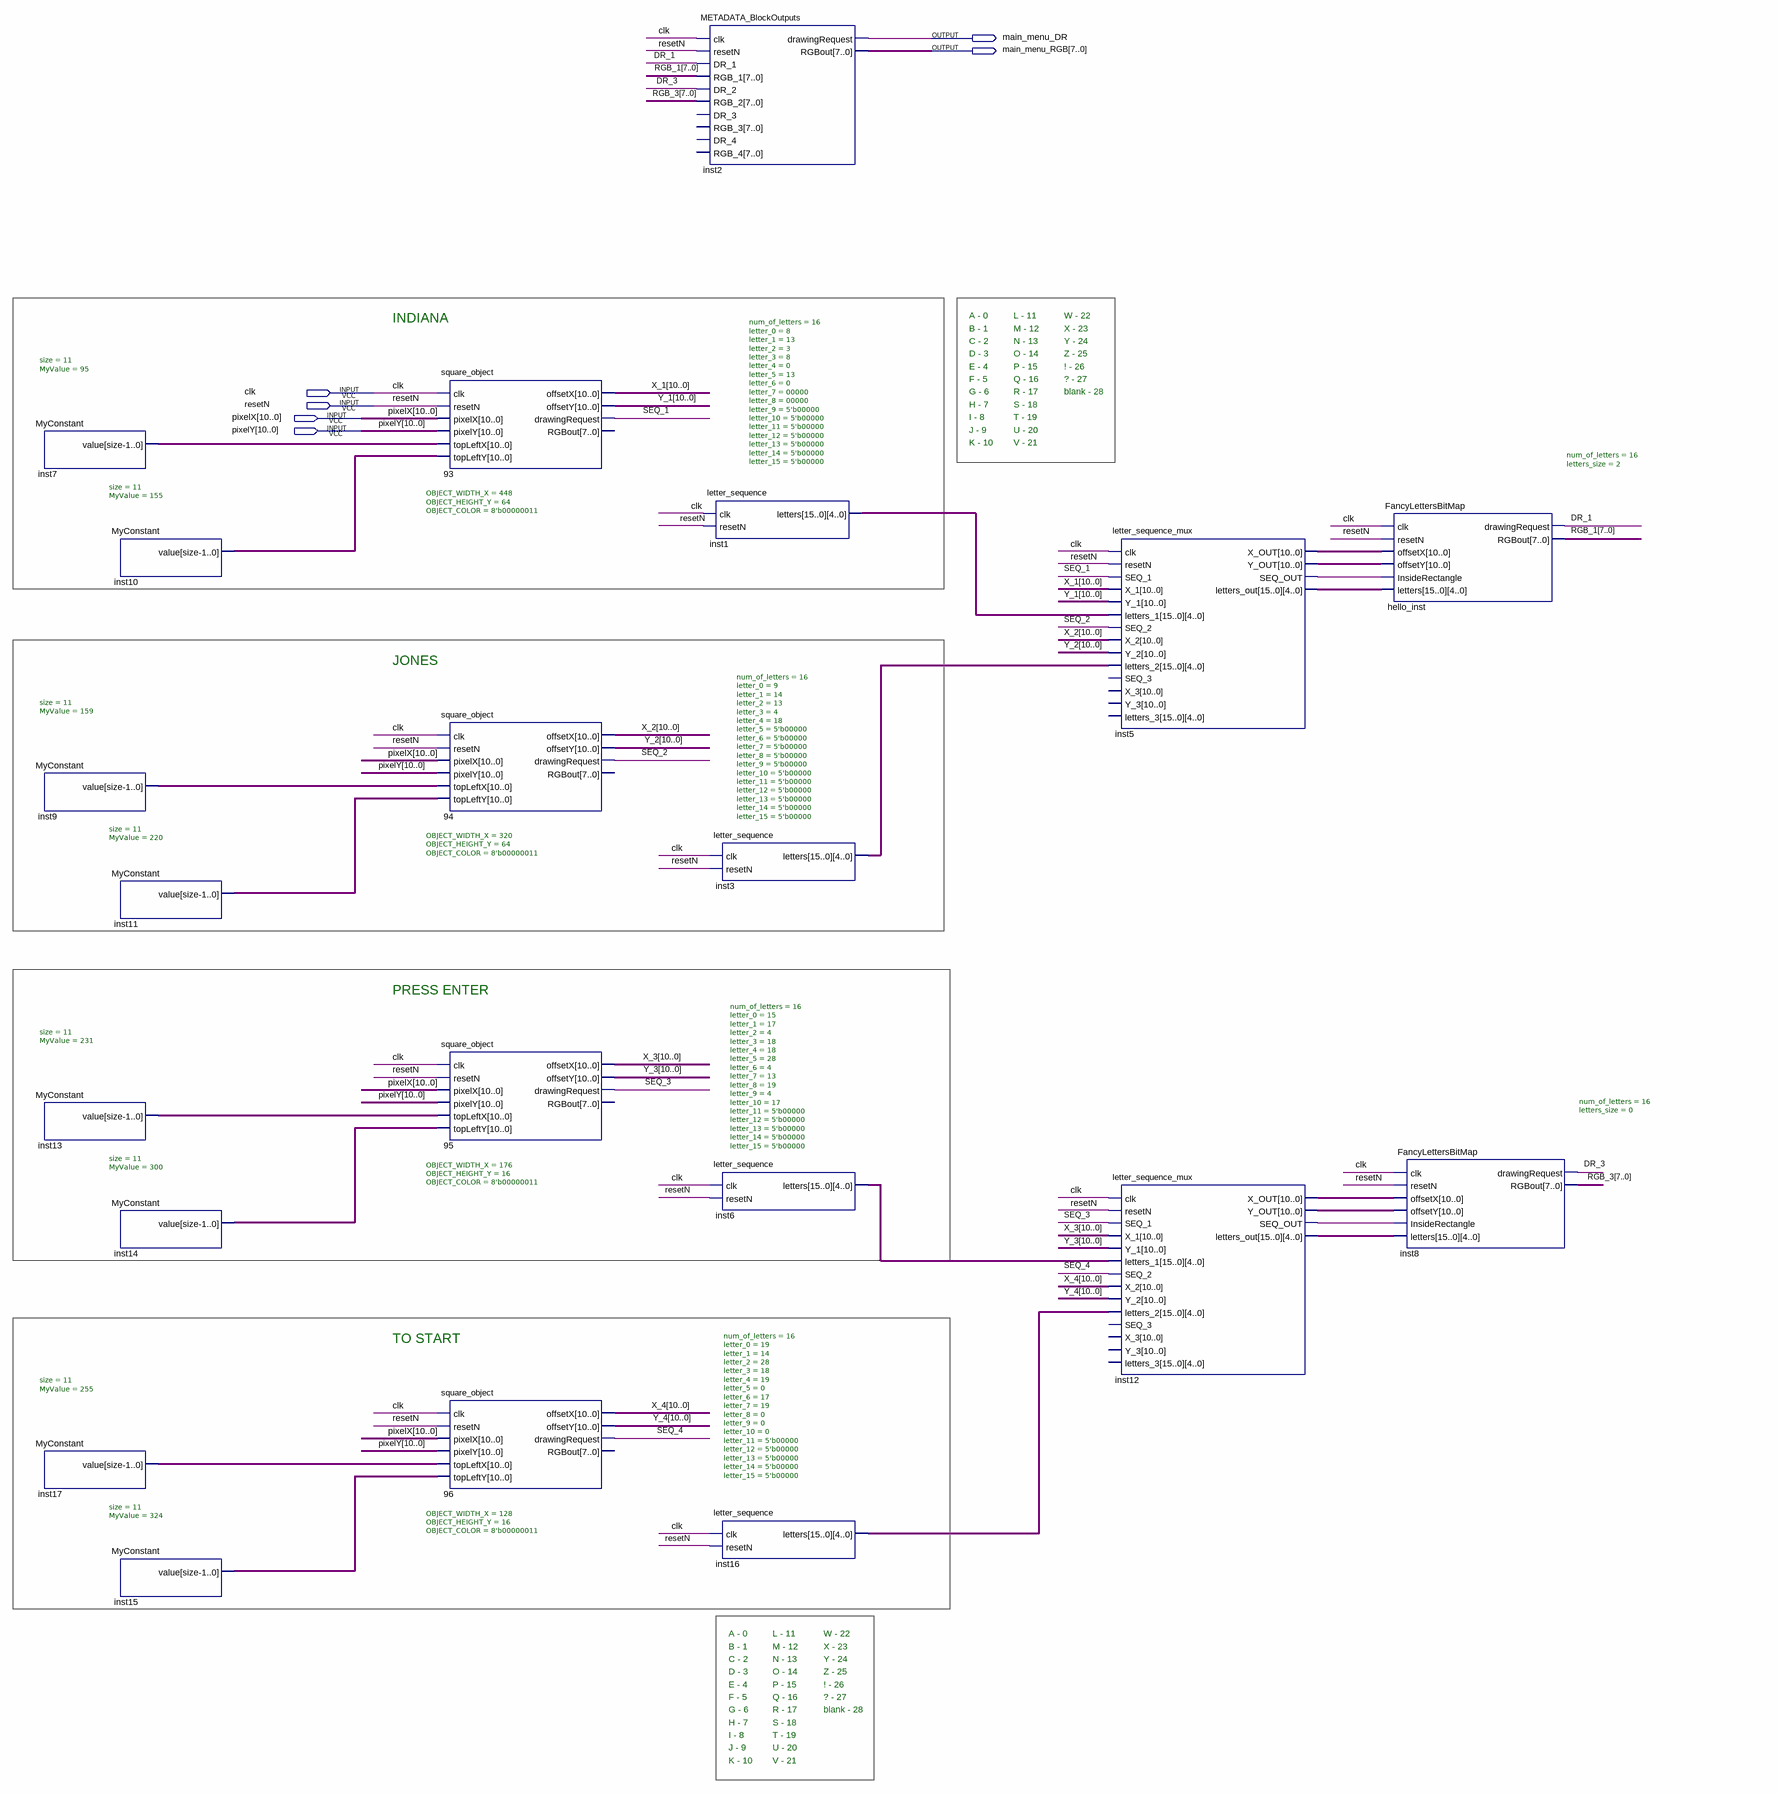
[diagram p0: schematic sheet]
// Quartus schematic Main_Menu_Screen_Block.bdf as structural Verilog: 21 symbols, 6 pins
module Main_Menu_Screen_Block (
  input  clk,
  input  resetN,
  input  [10:0] pixelX,
  input  [10:0] pixelY,
  output main_menu_DR,
  output [7:0] main_menu_RGB
);

  wire DR_1, DR_3, inst5_seq_out, inst12_seq_out, SEQ_1, SEQ_2, SEQ_3, SEQ_4;
  wire [7:0] RGB_1, RGB_3;
  wire [10:0] inst5_x_out, inst5_y_out, inst7_value, inst9_value, inst10_value, inst11_value, inst12_x_out,
       inst12_y_out, inst13_value, inst14_value, inst15_value, inst17_value, X_1, X_2, X_3, X_4, Y_1, Y_2,
       Y_3, Y_4;
  wire [79:0] inst1_letters, inst3_letters, inst5_letters_out, inst6_letters, inst12_letters_out,
       inst16_letters;

  MyConstant #(.size(11), .MyValue(95)) inst7 (.value(inst7_value));
  MyConstant #(.size(11), .MyValue(159)) inst9 (.value(inst9_value));
  MyConstant #(.size(11), .MyValue(231)) inst13 (.value(inst13_value));
  MyConstant #(.size(11), .MyValue(255)) inst17 (.value(inst17_value));
  MyConstant #(.size(11), .MyValue(155)) inst10 (.value(inst10_value));
  MyConstant #(.size(11), .MyValue(220)) inst11 (.value(inst11_value));
  MyConstant #(.size(11), .MyValue(300)) inst14 (.value(inst14_value));
  MyConstant #(.size(11), .MyValue(324)) inst15 (.value(inst15_value));
  square_object #(.OBJECT_WIDTH_X(448), .OBJECT_HEIGHT_Y(64), .OBJECT_COLOR(8'b00000011)) u_93 (
    .clk(clk), .resetN(resetN), .pixelX(pixelX), .pixelY(pixelY), .topLeftX(inst7_value),
    .topLeftY(inst10_value), .offsetX(X_1), .offsetY(Y_1), .drawingRequest(SEQ_1));  // open: RGBout
  square_object #(.OBJECT_WIDTH_X(320), .OBJECT_HEIGHT_Y(64), .OBJECT_COLOR(8'b00000011)) u_94 (
    .clk(clk), .resetN(resetN), .pixelX(pixelX), .pixelY(pixelY), .topLeftX(inst9_value),
    .topLeftY(inst11_value), .offsetX(X_2), .offsetY(Y_2), .drawingRequest(SEQ_2));  // open: RGBout
  square_object #(.OBJECT_WIDTH_X(176), .OBJECT_HEIGHT_Y(16), .OBJECT_COLOR(8'b00000011)) u_95 (
    .clk(clk), .resetN(resetN), .pixelX(pixelX), .pixelY(pixelY), .topLeftX(inst13_value),
    .topLeftY(inst14_value), .offsetX(X_3), .offsetY(Y_3), .drawingRequest(SEQ_3));  // open: RGBout
  square_object #(.OBJECT_WIDTH_X(128), .OBJECT_HEIGHT_Y(16), .OBJECT_COLOR(8'b00000011)) u_96 (
    .clk(clk), .resetN(resetN), .pixelX(pixelX), .pixelY(pixelY), .topLeftX(inst17_value),
    .topLeftY(inst15_value), .offsetX(X_4), .offsetY(Y_4), .drawingRequest(SEQ_4));  // open: RGBout
  METADATA_BlockOutputs inst2 (
    .clk(clk), .resetN(resetN), .DR_1(DR_1), .RGB_1(RGB_1), .DR_2(DR_3), .RGB_2(RGB_3),
    .drawingRequest(main_menu_DR), .RGBout(main_menu_RGB));  // open: DR_3, RGB_3, DR_4, RGB_4
  letter_sequence #(.num_of_letters(16), .letter_0(8), .letter_1(13), .letter_2(3), .letter_3(8), .letter_4(0), .letter_5(13), .letter_6(0), .letter_7(00000), .letter_8(00000), .letter_9(5'b00000), .letter_10(5'b00000), .letter_11(5'b00000), .letter_12(5'b00000), .letter_13(5'b00000), .letter_14(5'b00000), .letter_15(5'b00000)) inst1 (
    .clk(clk), .resetN(resetN), .letters(inst1_letters));
  letter_sequence #(.num_of_letters(16), .letter_0(9), .letter_1(14), .letter_2(13), .letter_3(4), .letter_4(18), .letter_5(5'b00000), .letter_6(5'b00000), .letter_7(5'b00000), .letter_8(5'b00000), .letter_9(5'b00000), .letter_10(5'b00000), .letter_11(5'b00000), .letter_12(5'b00000), .letter_13(5'b00000), .letter_14(5'b00000), .letter_15(5'b00000)) inst3 (
    .clk(clk), .resetN(resetN), .letters(inst3_letters));
  letter_sequence #(.num_of_letters(16), .letter_0(15), .letter_1(17), .letter_2(4), .letter_3(18), .letter_4(18), .letter_5(28), .letter_6(4), .letter_7(13), .letter_8(19), .letter_9(4), .letter_10(17), .letter_11(5'b00000), .letter_12(5'b00000), .letter_13(5'b00000), .letter_14(5'b00000), .letter_15(5'b00000)) inst6 (
    .clk(clk), .resetN(resetN), .letters(inst6_letters));
  letter_sequence #(.num_of_letters(16), .letter_0(19), .letter_1(14), .letter_2(28), .letter_3(18), .letter_4(19), .letter_5(0), .letter_6(17), .letter_7(19), .letter_8(0), .letter_9(0), .letter_10(0), .letter_11(5'b00000), .letter_12(5'b00000), .letter_13(5'b00000), .letter_14(5'b00000), .letter_15(5'b00000)) inst16 (
    .clk(clk), .resetN(resetN), .letters(inst16_letters));
  letter_sequence_mux inst5 (
    .clk(clk), .resetN(resetN), .SEQ_1(SEQ_1), .X_1(X_1), .Y_1(Y_1), .letters_1(inst1_letters),
    .SEQ_2(SEQ_2), .X_2(X_2), .Y_2(Y_2), .letters_2(inst3_letters), .X_OUT(inst5_x_out), .Y_OUT(inst5_y_out),
    .SEQ_OUT(inst5_seq_out), .letters_out(inst5_letters_out));  // open: SEQ_3, X_3, Y_3, letters_3
  letter_sequence_mux inst12 (
    .clk(clk), .resetN(resetN), .SEQ_1(SEQ_3), .X_1(X_3), .Y_1(Y_3), .letters_1(inst6_letters),
    .SEQ_2(SEQ_4), .X_2(X_4), .Y_2(Y_4), .letters_2(inst16_letters), .X_OUT(inst12_x_out),
    .Y_OUT(inst12_y_out), .SEQ_OUT(inst12_seq_out), .letters_out(inst12_letters_out));  // open: SEQ_3, X_3, Y_3, letters_3
  FancyLettersBitMap #(.num_of_letters(16), .letters_size(2)) hello_inst (
    .clk(clk), .resetN(resetN), .offsetX(inst5_x_out), .offsetY(inst5_y_out),
    .InsideRectangle(inst5_seq_out), .letters(inst5_letters_out), .drawingRequest(DR_1), .RGBout(RGB_1));
  FancyLettersBitMap #(.num_of_letters(16), .letters_size(0)) inst8 (
    .clk(clk), .resetN(resetN), .offsetX(inst12_x_out), .offsetY(inst12_y_out),
    .InsideRectangle(inst12_seq_out), .letters(inst12_letters_out), .drawingRequest(DR_3), .RGBout(RGB_3));

  // Notes on the sheet:
  //   INDIANA
  //   A - 0
  //   L - 11
  //   W - 22
  //   B - 1
  //   M - 12
  //   X - 23
  //   C - 2
  //   N - 13
  //   Y - 24
  //   D - 3
  //   O - 14
  //   Z - 25
  //   E - 4
  //   P - 15
  //   ! - 26
  //   F - 5
  //   Q - 16
  //   ? - 27
  //   G - 6
  //   R - 17
  //   blank - 28
  //   H - 7
  //   S - 18
  //   I - 8
  //   T - 19
  //   J - 9
  //   U - 20
  //   K - 10
  //   V - 21
  //   JONES
  //   PRESS ENTER
  //   TO START
  //   A - 0
  //   L - 11
  //   W - 22
  //   B - 1
  //   M - 12
  //   X - 23
  //   C - 2
  //   N - 13
  //   Y - 24
  //   D - 3
  //   O - 14
  //   Z - 25
  //   E - 4
  //   P - 15
  //   ! - 26
  //   F - 5
  //   Q - 16
  //   ? - 27
  //   G - 6
  //   R - 17
  //   blank - 28
  //   H - 7
  //   S - 18
  //   I - 8
  //   T - 19
  //   J - 9
  //   U - 20
  //   K - 10
  //   V - 21
endmodule
